# Altium schematic sheet Comparator.SchDoc
size A4
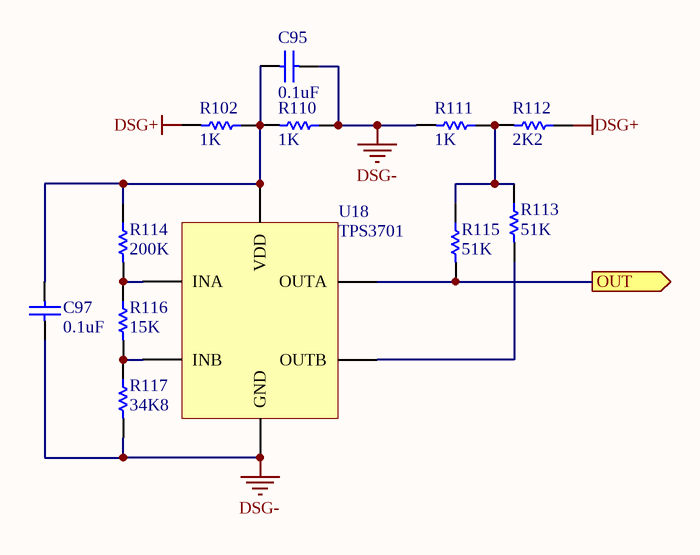
[diagram p0: Comparator.SchDoc]

## Parts
C95  value 0.1uF  [C0603[1608X92]]  (hidden comment: 0.1uF 100V 0603)
C97  value 0.1uF  [C0603[1608X92]]  (hidden comment: 0.1uF 100V 0603)
R102  value 1K  [R0603[1608]]  (hidden comment: 1K 1% 0603)
R110  value 1K  [R0603[1608]]  (hidden comment: 1K 1% 0603)
R111  value 1K  [R0603[1608]]  (hidden comment: 1K 1% 0603)
R112  value 2K2  [R0603[1608]]  (hidden comment: 2K2 1% 0603)
R113  value 51K  [R0603[1608]]  (hidden comment: 51K 1% 0603)
R114  value 200K  [R0603[1608]]  (hidden comment: 200K 1% 0603)
R115  value 51K  [R0603[1608]]  (hidden comment: 51K 1% 0603)
R116  value 15K  [R0603[1608]]  (hidden comment: 15K 1% 0603)
R117  value 34K8  [R0603[1608]]  (hidden comment: 34K8 1% 0603)
U18  TPS3701  [SOT-23-6]

## Ports
OUT (out)

## Nets
DSG+: R102.1 R112.2
DSG-: C95.2 C97.1 R110.2 R111.1 R117.1 U18.2(GND)
OUT: R115.1 U18.1(OUTA) ; port OUT
NetC95_1: C95.1 C97.2 R102.2 R110.1 R114.2 U18.5(VDD)
NetR111_2: R111.2 R112.1 R113.2 R115.2
NetR113_1: R113.1 U18.6(OUTB)
NetR114_1: R114.1 R116.2 U18.3(INA)
NetR116_1: R116.1 R117.2 U18.4(INB)

## Library data of the parts
C95 C97 = CAP_0.1uF_100V_0603_10%: 0.1uF 100V 10% 0603 (1608 Metric); PartNumber: GRM188R72A104KA35D; Manufacturer: Murata; TemperatureCoefficient: X7R; Mounting Technology: Surface Mount; PackageReference: 0603; PackageDescription: 0603 (1608 Metric); Voltage: 100V; Tolerance: 10%
R102 R110 R111 = RES_1K_0603_1%: 1K 0.25W 1% 0603 (1005 Metric); Manufacturer: Vishay / Dale; PartNumber: CRCW06031K00FKEAHP; Tolerance: 1%; Power: 0.25W; Mounting Technology: Surface Mount; PackageReference: 0603; PackageDescription: 0603 (1608 Metric); ComponentLink1Description: Datasheet; ComponentLink1URL: http://www.vishay.com/docs/20043/crcwhpe3.pdf
R112 = RES_2K2_0603_1%: 2K2 0.25W 1% 0603 (1005 Metric); Manufacturer: Vishay / Dale; PartNumber: CRCW06032K20FKEAHP; Tolerance: 1%; Power: 0.25W; Mounting Technology: Surface Mount; PackageReference: 0603; PackageDescription: 0603 (1608 Metric); ComponentLink1Description: Datasheet; ComponentLink1URL: http://www.vishay.com/docs/20043/crcwhpe3.pdf
R113 R115 = RES_51K_0603_1%: 51K 0.25W 1% 0603 (1005 Metric); Manufacturer: Panasonic; PartNumber: ERJ-PA3F5102V; Tolerance: 1%; Power: 0.25W; Mounting Technology: Surface Mount; PackageReference: 0603; PackageDescription: 0603 (1608 Metric); ComponentLink1Description: Datasheet; ComponentLink1URL: http://www.vishay.com/docs/20043/crcwhpe3.pdf
R114 = RES_200K_0603_1%: 200K 0.25W 1% 0603 (1005 Metric); Manufacturer: Rohm Semiconductor; PartNumber: ESR03EZPJ204; Tolerance: 5%; Power: 0.25W; Mounting Technology: Surface Mount; PackageReference: 0603; PackageDescription: 0603 (1608 Metric); ComponentLink1Description: Datasheet; ComponentLink1URL: http://www.vishay.com/docs/20043/crcwhpe3.pdf
R116 = RES_15K_0603_1%: 15K 0.25W 1% 0603 (1005 Metric); Manufacturer: Vishay / Dale; PartNumber: CRCW060315K0FKEAHP; Tolerance: 1%; Power: 0.25W; Mounting Technology: Surface Mount; PackageReference: 0603; PackageDescription: 0603 (1608 Metric); ComponentLink1Description: Datasheet; ComponentLink1URL: http://www.vishay.com/docs/20043/crcwhpe3.pdf
R117 = RES_34K8_0603_1%: 34K8 0.1W 1% 0603 (1005 Metric); Manufacturer: Panasonic; PartNumber: ERJ-3EKF3482V; Tolerance: 1%; Power: 0.1W; Mounting Technology: Surface Mount; PackageReference: 0603; PackageDescription: 0603 (1608 Metric); ComponentLink1Description: Datasheet; ComponentLink1URL: http://www.vishay.com/docs/20043/crcwhpe3.pdf
U18 = TPS3701: Manufacturer: Texas Instruments; Mounting Technology: Surface Mount; PackageDescription: SOP, 6-Leads, Body 3x3mm, Pitch 0.65mm, IPC Medium Density; PackageReference: SOT-23-6; PartNumber: TPS3701